# Altium schematic sheet 08-Connectors.SchDoc
size A
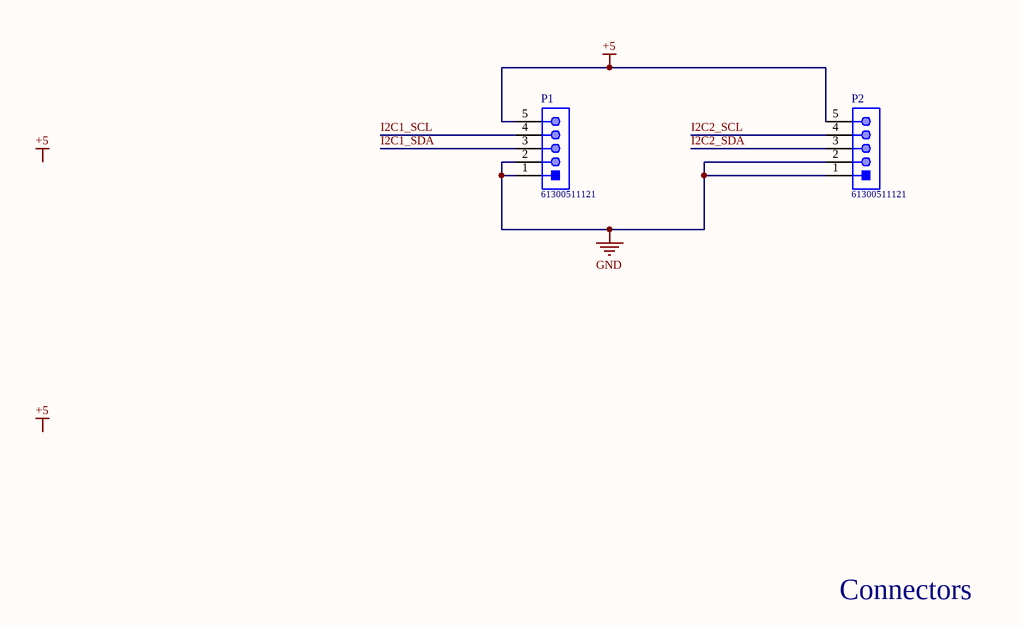
[diagram p0: 08-Connectors.SchDoc]

## Parts
P1  61300511121  [61300511121]
P2  61300511121  [61300511121]

## Nets
+5: P1.5 P2.5
GND: P1.1 P1.2 P2.1 P2.2
I2C1_SCL: P1.4
I2C1_SDA: P1.3
I2C2_SCL: P2.4
I2C2_SDA: P2.3

## Notes on the sheet
- Connectors
- Labels drawn without touching a wire or pin: +5

## Library data of the parts
P1 P2 = CMP-1502-01068-1: THT Vertical Pin Header WR-PHD, Pitch 2.54 mm, Single Row, 5 pins; Manufacturer: Wurth Elektronik; Pin Number: 5; Contact Resistance: 20mOhm; Working Voltage: 250VAC; Pitch: 2.54mm; Withstanding Voltage: 500VAC; Rated Current: 3A; Gender: Male; Datasheet URL: https://katalog.we-online.de/em/datasheet/6130xx11121.pdf; Orientation: Vertical; Mounting Technology: THT; Row Number: Single; Package Reference: 61300511121; Publisher: WurthElektronik; Part Number: 61300511121; Packaging: Bag; Manufacturer URL: http://www.we-online.de; Operating Temperature: -40to105degC